# Altium schematic sheet RK3566_NC.SchDoc
size A3; SheetNumber: 6; SheetTotal: 7
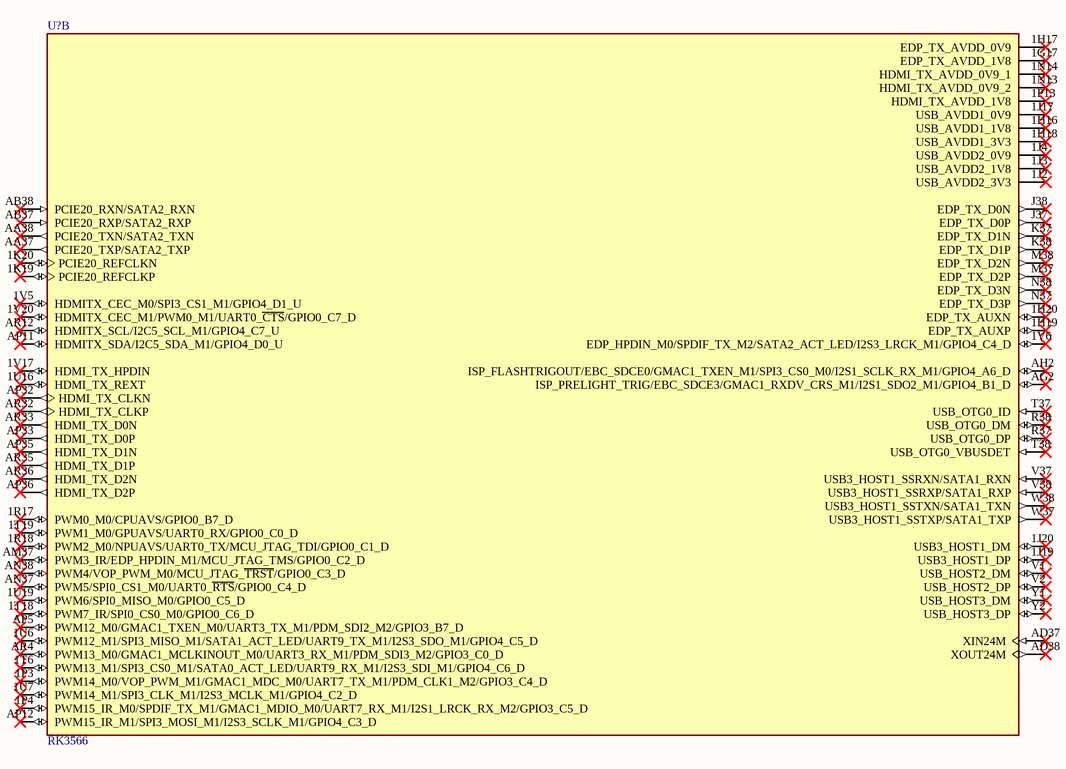
[diagram p0: RK3566_NC.SchDoc]

## Parts
U?  RK3566  [RK3566]  (part B of 9)

## Nets

Not connected (* = marked no-connect by the designer): U? 1G17(EDP_TX_AVDD_1V8)* 1H16(USB_AVDD1_1V8)* 1H17(EDP_TX_AVDD_0V9)* 1H18(USB_AVDD1_3V3)* 1H19(EDP_TX_AUXP)* 1H20(EDP_TX_AUXN)* 1J2(USB_AVDD2_3V3)* 1J3(USB_AVDD2_1V8)* 1J4(USB_AVDD2_0V9)* 1J17(USB_AVDD1_0V9)* 1J19(USB3_HOST1_DP)* 1J20(USB3_HOST1_DM)* 1K19(PCIE20_REFCLKP)* 1K20(PCIE20_REFCLKN)* 1N13(HDMI_TX_AVDD_0V9_2)* 1N14(HDMI_TX_AVDD_0V9_1)* 1P3(PWM14_M0/VOP_PWM_M1/GMAC1_MDC_M0/UART7_TX_M1/PDM_CLK1_M2/GPIO3_C4_D)* 1P4(PWM15_IR_M0/SPDIF_TX_M1/GMAC1_MDIO_M0/UART7_RX_M1/I2S1_LRCK_RX_M2/GPIO3_C5_D)* 1P13(HDMI_TX_AVDD_1V8)* 1R17(PWM0_M0/CPUAVS/GPIO0_B7_D)* 1R18(PWM2_M0/NPUAVS/UART0_TX/MCU_JTAG_TDI/GPIO0_C1_D)* 1T6(PWM13_M1/SPI3_CS0_M1/SATA0_ACT_LED/UART9_RX_M1/I2S3_SDI_M1/GPIO4_C6_D)* 1T18(PWM7_IR/SPI0_CS0_M0/GPIO0_C6_D)* 1T19(PWM1_M0/GPUAVS/UART0_RX/GPIO0_C0_D)* 1U6(PWM12_M1/SPI3_MISO_M1/SATA1_ACT_LED/UART9_TX_M1/I2S3_SDO_M1/GPIO4_C5_D)* 1U7(PWM14_M1/SPI3_CLK_M1/I2S3_MCLK_M1/GPIO4_C2_D)* 1U16(HDMI_TX_REXT)* 1U19(PWM6/SPI0_MISO_M0/GPIO0_C5_D)* 1V5(HDMITX_CEC_M0/SPI3_CS1_M1/GPIO4_D1_U)* 1V6(EDP_HPDIN_M0/SPDIF_TX_M2/SATA2_ACT_LED/I2S3_LRCK_M1/GPIO4_C4_D)* 1V17(HDMI_TX_HPDIN)* 1V20(HDMITX_CEC_M1/PWM0_M1/UART0_~{CTS}/GPIO0_C7_D)* AA37(PCIE20_TXP/SATA2_TXP)* AA38(PCIE20_TXN/SATA2_TXN)* AB37(PCIE20_RXP/SATA2_RXP)* AB38(PCIE20_RXN/SATA2_RXN)* AD37(XIN24M)* AD38(XOUT24M)* AG2(ISP_PRELIGHT_TRIG/EBC_SDCE3/GMAC1_RXDV_CRS_M1/I2S1_SDO2_M1/GPIO4_B1_D)* AH2(ISP_FLASHTRIGOUT/EBC_SDCE0/GMAC1_TXEN_M1/SPI3_CS0_M0/I2S1_SCLK_RX_M1/GPIO4_A6_D)* AM37(PWM3_IR/EDP_HPDIN_M1/MCU_JTAG_TMS/GPIO0_C2_D)* AN37(PWM5/SPI0_CS1_M0/UART0_~{RTS}/GPIO0_C4_D)* AN38(PWM4/VOP_PWM_M0/MCU_JTAG_~{TRST}/GPIO0_C3_D)* AP5(PWM12_M0/GMAC1_TXEN_M0/UART3_TX_M1/PDM_SDI2_M2/GPIO3_B7_D)* AP11(HDMITX_SDA/I2C5_SDA_M1/GPIO4_D0_U)* AP12(PWM15_IR_M1/SPI3_MOSI_M1/I2S3_SCLK_M1/GPIO4_C3_D)* AP32(HDMI_TX_CLKN)* AP33(HDMI_TX_D0P)* AP35(HDMI_TX_D1N)* AP36(HDMI_TX_D2P)* AR4(PWM13_M0/GMAC1_MCLKINOUT_M0/UART3_RX_M1/PDM_SDI3_M2/GPIO3_C0_D)* AR12(HDMITX_SCL/I2C5_SCL_M1/GPIO4_C7_U)* AR32(HDMI_TX_CLKP)* AR33(HDMI_TX_D0N)* AR35(HDMI_TX_D1P)* AR36(HDMI_TX_D2N)* J37(EDP_TX_D0P)* J38(EDP_TX_D0N)* K37(EDP_TX_D1N)* K38(EDP_TX_D1P)* M37(EDP_TX_D2P)* M38(EDP_TX_D2N)* N37(EDP_TX_D3P)* N38(EDP_TX_D3N)* R37(USB_OTG0_DP)* R38(USB_OTG0_DM)* T37(USB_OTG0_ID)* T38(USB_OTG0_VBUSDET)* V1(USB_HOST2_DM)* V2(USB_HOST2_DP)* V37(USB3_HOST1_SSRXN/SATA1_RXN)* V38(USB3_HOST1_SSRXP/SATA1_RXP)* W37(USB3_HOST1_SSTXP/SATA1_TXP)* W38(USB3_HOST1_SSTXN/SATA1_TXN)* Y1(USB_HOST3_DM)* Y2(USB_HOST3_DP)*

## Library data of the parts
U? = RK3566: high-performance and low-power quad-core application processor; MF: Fuzhou Rockchip Electronics Co; SnapEDA_Link: https://www.snapeda.com/parts/RK3566/Fuzhou+Rockchip+Electronics+Co/view-part/?ref=snap; Package: None; Value: *; MP: RK3566; Check_prices: https://www.snapeda.com/parts/RK3566/Fuzhou+Rockchip+Electronics+Co/view-part/?ref=eda